# Altium schematic sheet SCH_5_Vibration Motor.SchDoc
size A
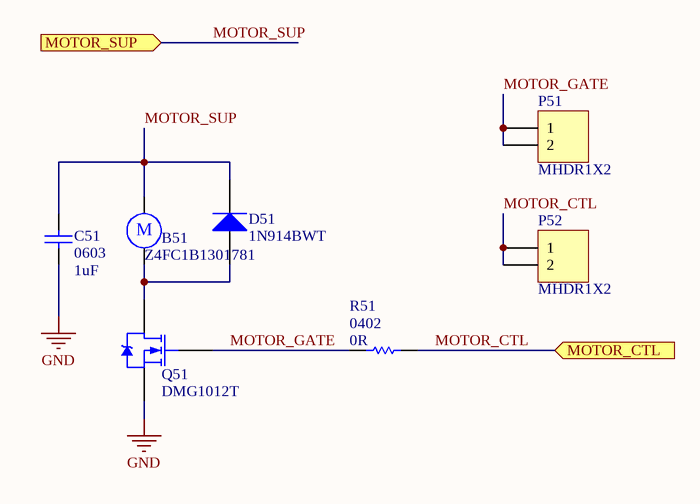
[diagram p0: SCH_5_Vibration Motor.SchDoc]

## Parts
B51  Z4FC1B1301781  [Z4FC1B1301781]
C51  0603  value 1uF  [CAPC1608X10N]
D51  1N914BWT  [SODFL160X70-2N]
P51  MHDR1X2  [MHDR1X2]
P52  MHDR1X2  [MHDR1X2]
Q51  DMG1012T  [SOT65P200X125X95-3N]
R51  0402  value 0R  [RESC1005X04N]

## Ports
MOTOR_CTL (in), MOTOR_SUP (in)

## Nets
GND: C51.1 Q51.2(S)
MOTOR_CTL: P52.1 P52.2 R51.2 ; port MOTOR_CTL
MOTOR_GATE: P51.1 P51.2 Q51.1(G) R51.1
MOTOR_SUP: B51.1 C51.2 D51.2(K) ; port MOTOR_SUP
NetB51_2: B51.2 D51.1(A) Q51.3(D)

## Notes on the sheet
- (in symbol Z4FC1B1301781) M

## Library data of the parts
B51 = Z4FC1B1301781: VIBRATION MOTOR CYL 2.7V SMD; Manufacturer: Jinlong Machinery & Electronics; RPM: 10000RPM; Supplier 1: Digi-Key; Manufacturer Part Number: Z4FC1B1301781; Stock 1: 7323; Pricing 1: 1=3.49, 5=3.302, 10=3.21, 25=3.1184, 50=2.843, 100=2.568, 250=2.4762, 500=2.4396 (USD); Min Operating Temperature: -20°C; Max Operating Temperature: 70°C; Termination: SMD/SMT
C51 = Cap: Capacitor; Published: 8-Jun-2000; LatestRevisionDate: 17-Jul-2002; LatestRevisionNote: Re-released for DXP Platform.; PackageReference: RAD-0.3; Publisher: Altium Limited; PackageDescription: Radial Cap, Thru-Hole; 2 Leads; 0.3 in Pin Spacing
D51 = 1N914BWT: DIODE GEN PURP 75V 200MA SOD523F; Manufacturer: ON Semiconductor / Fairchild; Peak Reverse Current: 5uA; Element Configuration: Single; Forward Current: 300mA; Forward Voltage: 1V; Reverse Recovery Time: 4ns; Power Dissipation: 200mW; Supplier 1: Digi-Key; Manufacturer Part Number: 1N914BWT; Stock 1: 39736; Pricing 1: 1=0.17, 10=0.159, 100=0.0866, 500=0.0533, 1000=0.0364 (USD); Mount: Surface Mount; Number of Pins: 2; Weight: 0.01g; Contact Plating: Tin,Matte; Min Operating Temperature: -55°C; Max Operating Temperature: 150°C; Max Repetitive Reverse Voltage (Vrrm): 75V; Package Quantity: 1; Packaging: Tape and Reel; Average Rectified Current: 200mA; Max Reverse Voltage (DC): 75V; Recovery Time: 4ns; Max Reverse Leakage Current: 5uA; Radiation Hardening: No; Lead Free: Lead Free; REACH SVHC: No SVHC; ComponentLink1URL: https://datasheet.ciiva.com/910/1n914bwt-910384.pdf; ComponentLink1Description: https://datasheet.ciiva.com/910/1n914bwt-910384.pdf; ComponentLink2URL: https://datasheet.ciiva.com/910/1n914bwt-910385.pdf; ComponentLink2Description: https://datasheet.ciiva.com/910/1n914bwt-910385.pdf; ComponentLink3URL: https://datasheet.ciiva.com/910/1n914bwt-910383.pdf; ComponentLink3Description: https://datasheet.ciiva.com/910/1n914bwt-910383.pdf; ComponentLink4URL: https://datasheet.ciiva.com/25953/1n4448wt-25953279.pdf; ComponentLink4Description: https://datasheet.ciiva.com/25953/1n4448wt-25953279.pdf
P51 P52 = MHDR1X2: Header, 2-Pin; LatestRevisionDate: 17-Jul-2002; LatestRevisionNote: Re-released for DXP Platform.; Publisher: Altium Limited
Q51 = DMG1012T-7: MOSFET N-CH 20V 630MA SOT-523; Manufacturer: Diodes; Rds On Max: 400mR; Input Capacitance: 60.67pF; Max Power Dissipation: 280mW; Rise Time: 7.4ns; Fall Time: 12.3ns; Turn-On Delay Time: 5.1ns; Turn-Off Delay Time: 26.7ns; Gate to Source Voltage (Vgs): 6V; Number of Elements: 1; Drain to Source Resistance: 300mR; Threshold Voltage: 1V; Element Configuration: Single; FET Type: 1 N-Channel; Supplier 1: Digi-Key; Manufacturer Part Number: DMG1012T-7; Stock 1: 0; Pricing 1: 1=0.36, 10=0.326, 100=0.1824, 500=0.0977, 1000=0.0665 (USD); Mount: Surface Mount; Case/Package: SOT-523; Number of Pins: 3; Weight: 7.1E-05oz; Contact Plating: Tin,Matte; Min Operating Temperature: -55°C; Max Operating Temperature: 150°C; Continuous Drain Current (ID): 630mA; Packaging: Tape and Reel; Drain to Source Voltage (Vdss): 20V; Package Quantity: 3000; Number of Channels: 1; Drain to Source Breakdown Voltage: 20V; Power Dissipation: 280mW; On-State Resistance: 400MR; Length: 1.7mm; Height: 0.8mm; Width: 0.85mm; Radiation Hardening: No; REACH SVHC: No SVHC; Lead Free: Lead Free; ComponentLink1URL: https://datasheet.ciiva.com/934/ds31783-934512.pdf; ComponentLink1Description: https://datasheet.ciiva.com/934/ds31783-934512.pdf; ComponentLink2URL: https://datasheet.ciiva.com/4442/ds31783-44973-4442944.pdf; ComponentLink2Description: https://datasheet.ciiva.com/4442/ds31783-44973-4442944.pdf; ComponentLink3URL: https://datasheet.ciiva.com/11174/ds31783-11174965.pdf; ComponentLink3Description: https://datasheet.ciiva.com/11174/ds31783-11174965.pdf; ComponentLink4URL: https://datasheet.ciiva.com/17324/ds31783-17324010.pdf; ComponentLink4Description: https://datasheet.ciiva.com/17324/ds31783-17324010.pdf; ComponentLink5URL: https://datasheet.ciiva.com/6383/ds31783-6383803.pdf; ComponentLink5Description: https://datasheet.ciiva.com/6383/ds31783-6383803.pdf; ComponentLink6URL: https://datasheet.ciiva.com/934/ds31783-934511.pdf; ComponentLink6Description: https://datasheet.ciiva.com/934/ds31783-934511.pdf
R51 = Res1: Resistor; Published: 8-Jun-2000; LatestRevisionDate: 17-Jul-2002; LatestRevisionNote: Re-released for DXP Platform.; PackageReference: AXIAL-0.3; Publisher: Altium Limited; PackageDescription: Axial Device, Thru-Hole; 2 Leads; 0.3 in Pin Spacing